# Altium schematic sheet GPSSchematic.SchDoc
size A3
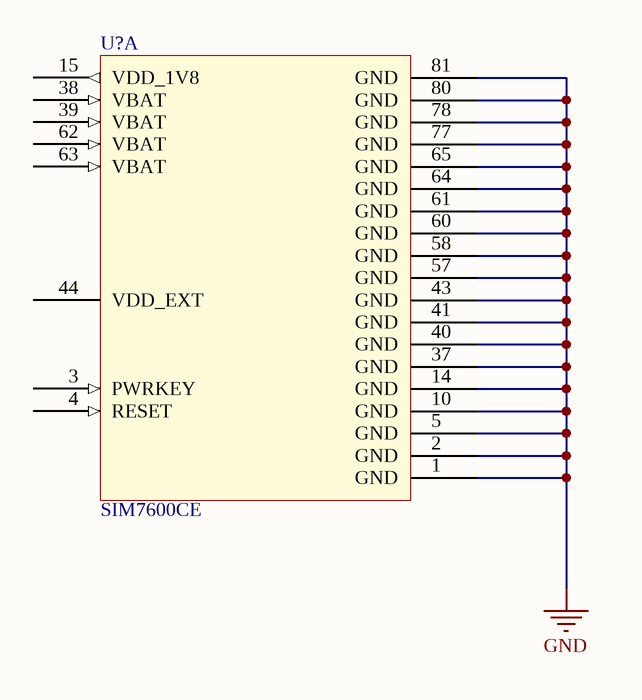
[diagram p0: GPSSchematic.SchDoc]

## Parts
U?  SIM7600CE  [sim7600ce]  (part A of 2)

## Nets
GND: U?.1(GND) U?.2(GND) U?.5(GND) U?.10(GND) U?.14(GND) U?.37(GND) U?.40(GND) U?.41(GND) U?.43(GND) U?.57(GND) U?.58(GND) U?.60(GND) U?.61(GND) U?.64(GND) U?.65(GND) U?.77(GND) U?.78(GND) U?.80(GND) U?.81(GND)

Not connected (* = marked no-connect by the designer): U? 3(PWRKEY) 4(RESET) 15(VDD_1V8) 38(VBAT) 39(VBAT) 44(VDD_EXT) 62(VBAT) 63(VBAT)